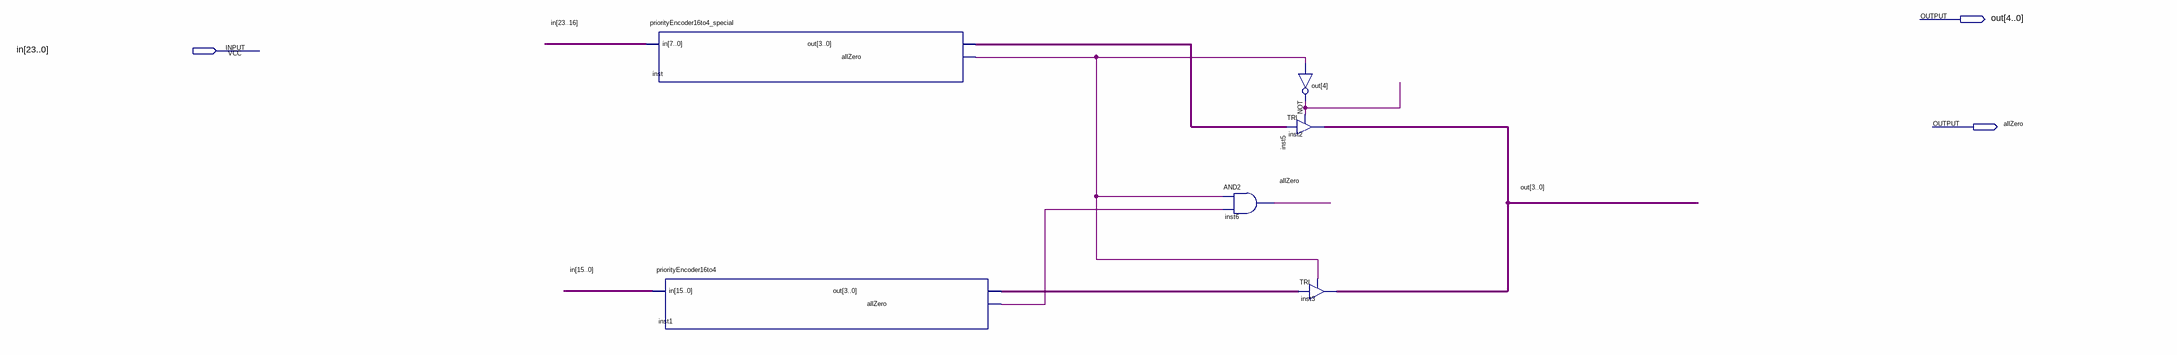
[diagram p0: schematic sheet]
// Quartus schematic priorityEncoderFinalVersion.bdf as structural Verilog: 6 symbols, 3 pins
module priorityEncoderFinalVersion (
  input  [23:0] in,
  output [4:0] out,
  output allZero
);

  wire inst1_allzero, inst_allzero;
  wire [3:0] inst1_out, inst_out;

  priorityEncoder16to4_special inst (.in(in[23:16]), .out(inst_out), .allZero(inst_allzero));
  priorityEncoder16to4 inst1 (.in(in[15:0]), .out(inst1_out), .allZero(inst1_allzero));
  and inst6 (allZero, inst_allzero, inst1_allzero);
  not inst5 (out[4], inst_allzero);
  TRI inst2[3:0] (.IN(inst_out), .OE(out[4]), .OUT(out[3:0]));
  TRI inst3[3:0] (.IN(inst1_out), .OE(inst_allzero), .OUT(out[3:0]));
endmodule
